# EasyEDA schematic TMS1_2025_INVERTED.json
TITLE: Sheet_1; REV: 1.0; Date: 2024-07-31; Sheet: 1/1; Drawn By: Matthew Bostock
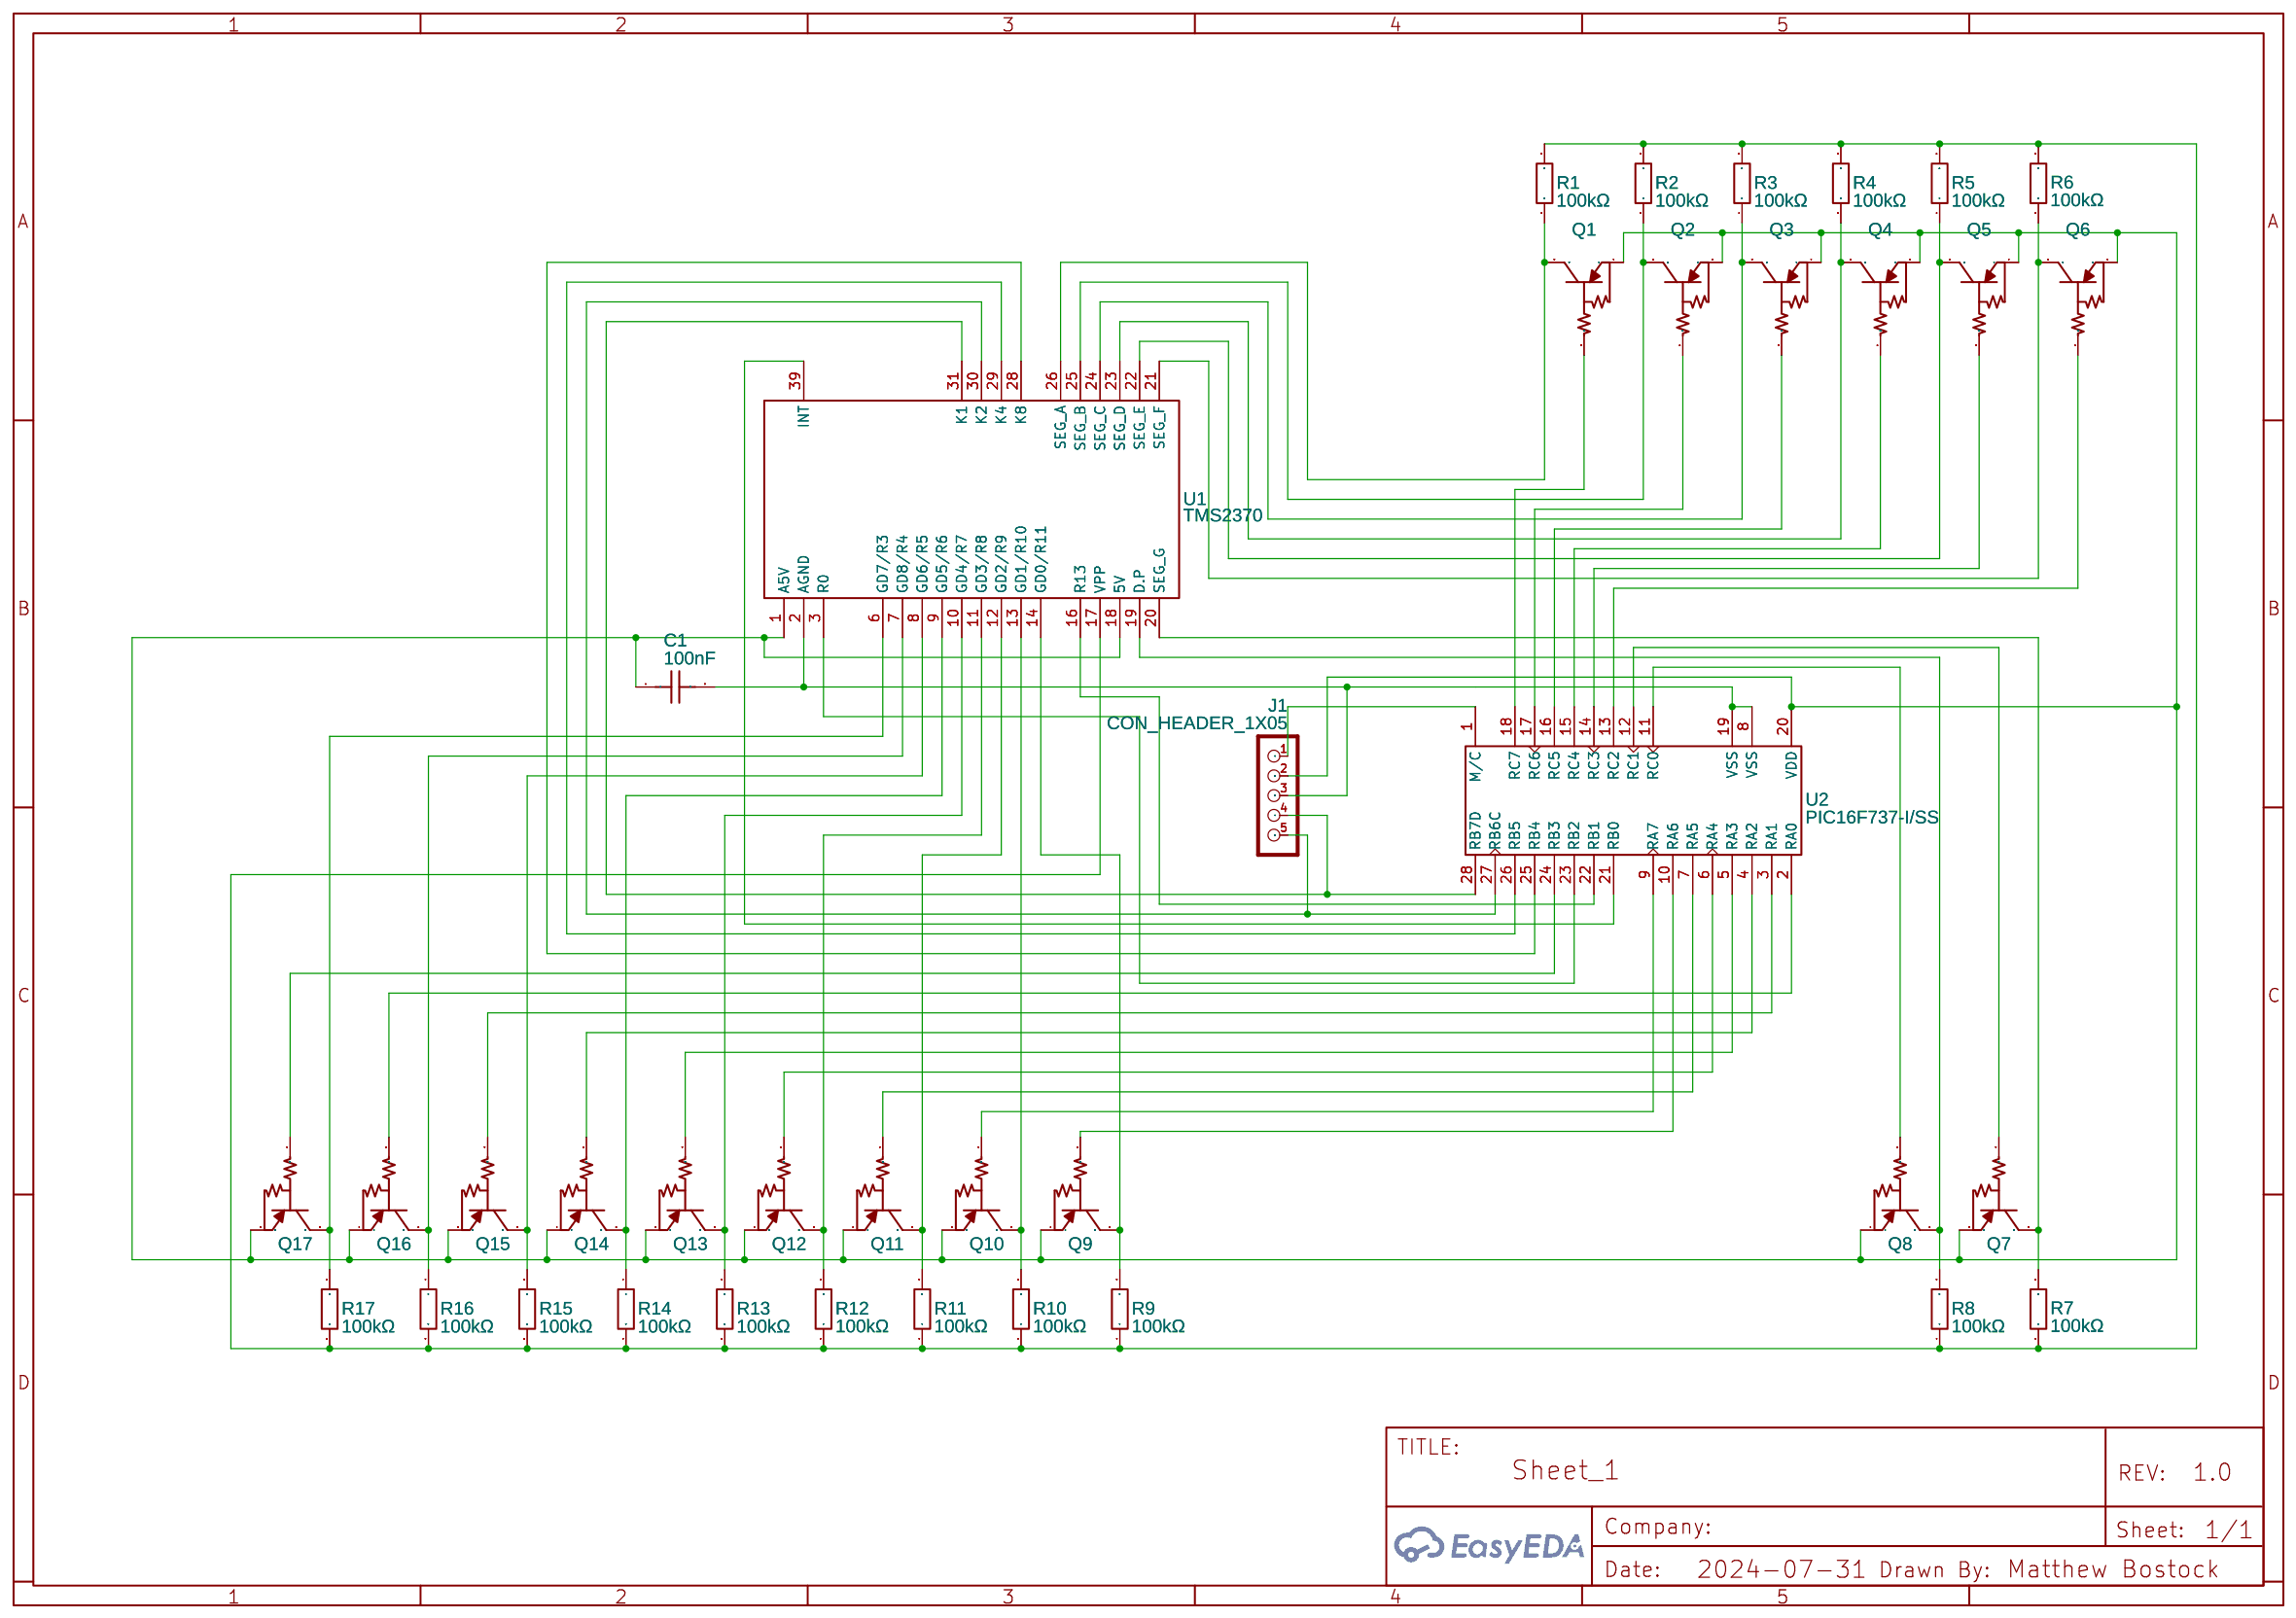
[diagram p0: schematic sheet]

## Parts
C1  100nF  [C0603]
J1  CON_HEADER_1X05  [M1X5_NO_SS]
Q1  DTB113ZKT146_SLIM  [SC-59-3_L2.9-W1.7-P0.95-LS2.8-BR_1_2_SWAP]
Q2  DTB113ZKT146_SLIM  [SC-59-3_L2.9-W1.7-P0.95-LS2.8-BR_1_2_SWAP]
Q3  DTB113ZKT146_SLIM  [SC-59-3_L2.9-W1.7-P0.95-LS2.8-BR_1_2_SWAP]
Q4  DTB113ZKT146_SLIM  [SC-59-3_L2.9-W1.7-P0.95-LS2.8-BR_1_2_SWAP]
Q5  DTB113ZKT146_SLIM  [SC-59-3_L2.9-W1.7-P0.95-LS2.8-BR_1_2_SWAP]
Q6  DTB113ZKT146_SLIM  [SC-59-3_L2.9-W1.7-P0.95-LS2.8-BR_1_2_SWAP]
Q7  DTB113ZKT146_SLIM  [SC-59-3_L2.9-W1.7-P0.95-LS2.8-BR_1_2_SWAP]
Q8  DTB113ZKT146_SLIM  [SC-59-3_L2.9-W1.7-P0.95-LS2.8-BR_1_2_SWAP]
Q9  DTB113ZKT146_SLIM  [SC-59-3_L2.9-W1.7-P0.95-LS2.8-BR_1_2_SWAP]
Q10  DTB113ZKT146_SLIM  [SC-59-3_L2.9-W1.7-P0.95-LS2.8-BR_1_2_SWAP]
Q11  DTB113ZKT146_SLIM  [SC-59-3_L2.9-W1.7-P0.95-LS2.8-BR_1_2_SWAP]
Q12  DTB113ZKT146_SLIM  [SC-59-3_L2.9-W1.7-P0.95-LS2.8-BR_1_2_SWAP]
Q13  DTB113ZKT146_SLIM  [SC-59-3_L2.9-W1.7-P0.95-LS2.8-BR_1_2_SWAP]
Q14  DTB113ZKT146_SLIM  [SC-59-3_L2.9-W1.7-P0.95-LS2.8-BR_1_2_SWAP]
Q15  DTB113ZKT146_SLIM  [SC-59-3_L2.9-W1.7-P0.95-LS2.8-BR_1_2_SWAP]
Q16  DTB113ZKT146_SLIM  [SC-59-3_L2.9-W1.7-P0.95-LS2.8-BR_1_2_SWAP]
Q17  DTB113ZKT146_SLIM  [SC-59-3_L2.9-W1.7-P0.95-LS2.8-BR_1_2_SWAP]
R1  100kΩ  [R0603]
R2  100kΩ  [R0603]
R3  100kΩ  [R0603]
R4  100kΩ  [R0603]
R5  100kΩ  [R0603]
R6  100kΩ  [R0603]
R7  100kΩ  [R0603]
R8  100kΩ  [R0603]
R9  100kΩ  [R0603]
R10  100kΩ  [R0603]
R11  100kΩ  [R0603]
R12  100kΩ  [R0603]
R13  100kΩ  [R0603]
R14  100kΩ  [R0603]
R15  100kΩ  [R0603]
R16  100kΩ  [R0603]
R17  100kΩ  [R0603]
U1  TMS2370  [TMS2370_DIP40_1.778_NO_SS]
U2  PIC16F737-I/SS  [SSOP-28_L10.2-W5.3-P0.65-LS7.8-TL]

## Library data of the parts
C1 = CC0603KRX7R9BB104: Supplier: LCSC; Manufacturer: YAGEO(国巨); Supplier Part: C14663; JLCPCB Part Class: Basic Part
J1 = CON_HEADER_1X05: Contributor: DangerousPrototype
Q1-Q17 = DTB113ZKT146_SLIM: Contributor: Matthew Bostock; Supplier: LCSC; Supplier Part: C509870; Manufacturer: ROHM(罗姆); Manufacturer Part: DTB113ZKT146; JLCPCB Part Class: Extended Part
R1-R17 = RC0603FR-07100KL: Contributor: LCSC; Supplier: LCSC; Supplier Part: C14675; Manufacturer: YAGEO(国巨); JLCPCB Part Class: Extended Part
U1 = TMS2370: Manufacturer: Texas Instruments; Contributor: Guest
U2 = PIC16F737-I/SO_SLIM: Supplier: LCSC; Manufacturer: MICROCHIP(美国微芯); Manufacturer Part: PIC16F737-I/SO; Supplier Part: C127941; JLCPCB Part Class: Extended Part; Contributor: Matthew Bostock

## Nets
Net-(C1-1): C1.1 J1.2 Q1.1(E) Q2.1(E) Q3.1(E) Q4.1(E) Q5.1(E) Q6.1(E) Q7.1(E) Q8.1(E) Q9.1(E) Q10.1(E) Q11.1(E) Q12.1(E) Q13.1(E) Q14.1(E) Q15.1(E) Q16.1(E) Q17.1(E) U1.1(A5V) U1.18(5V) U2.20(VDD)
Net-(C1-2): C1.2 J1.3 U1.2(AGND) U2.8(VSS) U2.19(VSS)
Net-(J1-1): J1.1 U2.1(M/C)
Net-(J1-4): J1.4 U1.31(K1) U2.28(RB7D)
Net-(J1-5): J1.5 U1.30(K2) U2.27(RB6C)
Net-(Q1-2): Q1.2(B) U2.18(RC7)
Net-(Q1-3): Q1.3(C) R1.1 U1.26(SEG_A)
Net-(Q2-2): Q2.2(B) U2.17(RC6)
Net-(Q2-3): Q2.3(C) R2.1 U1.25(SEG_B)
Net-(Q3-2): Q3.2(B) U2.16(RC5)
Net-(Q3-3): Q3.3(C) R3.1 U1.24(SEG_C)
Net-(Q4-2): Q4.2(B) U2.15(RC4)
Net-(Q4-3): Q4.3(C) R4.1 U1.23(SEG_D)
Net-(Q5-2): Q5.2(B) U2.14(RC3)
Net-(Q5-3): Q5.3(C) R5.1 U1.22(SEG_E)
Net-(Q6-2): Q6.2(B) U2.13(RC2)
Net-(Q6-3): Q6.3(C) R6.1 U1.21(SEG_F)
Net-(Q7-2): Q7.2(B) U2.12(RC1)
Net-(Q7-3): Q7.3(C) R7.2 U1.20(SEG_G)
Net-(Q8-2): Q8.2(B) U2.11(RC0)
Net-(Q8-3): Q8.3(C) R8.2 U1.19(D.P)
Net-(Q9-2): Q9.2(B) U2.10(RA6)
Net-(Q9-3): Q9.3(C) R9.2 U1.14(GD0/R11)
Net-(Q10-2): Q10.2(B) U2.9(RA7)
Net-(Q10-3): Q10.3(C) R10.2 U1.13(GD1/R10)
Net-(Q11-2): Q11.2(B) U2.7(RA5)
Net-(Q11-3): Q11.3(C) R11.2 U1.12(GD2/R9)
Net-(Q12-2): Q12.2(B) U2.6(RA4)
Net-(Q12-3): Q12.3(C) R12.2 U1.11(GD3/R8)
Net-(Q13-2): Q13.2(B) U2.5(RA3)
Net-(Q13-3): Q13.3(C) R13.1 U1.10(GD4/R7)
Net-(Q14-2): Q14.2(B) U2.4(RA2)
Net-(Q14-3): Q14.3(C) R14.1 U1.9(GD5/R6)
Net-(Q15-2): Q15.2(B) U2.3(RA1)
Net-(Q15-3): Q15.3(C) R15.1 U1.8(GD6/R5)
Net-(Q16-2): Q16.2(B) U2.2(RA0)
Net-(Q16-3): Q16.3(C) R16.1 U1.7(GD8/R4)
Net-(Q17-2): Q17.2(B) U2.24(RB3)
Net-(Q17-3): Q17.3(C) R17.1 U1.6(GD7/R3)
Net-(R1-2): R1.2 R2.2 R3.2 R4.2 R5.2 R6.2 R7.1 R8.1 R9.1 R10.1 R11.1 R12.1 R13.2 R14.2 R15.2 R16.2 R17.2 U1.17(VPP)
Net-(U1-3): U1.3(R0) U2.23(RB2)
Net-(U1-16): U1.16(R13) U2.22(RB1)
Net-(U1-28): U1.28(K8) U2.25(RB4)
Net-(U1-29): U1.29(K4) U2.26(RB5)
Net-(U1-39): U1.39(INT) U2.21(RB0)
